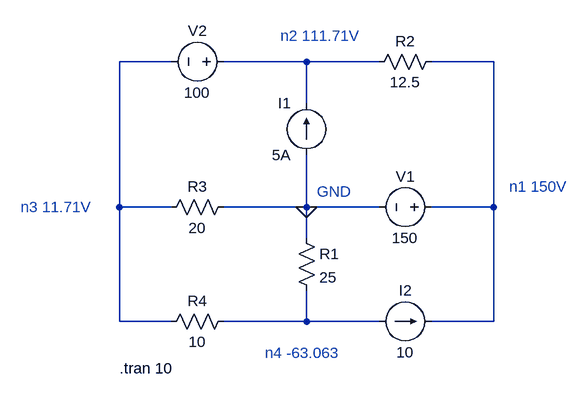
[diagram p0: schematic tc3_sim.asc]
tc3_sim.asc, the LTspice schematic file:
Version 4
SHEET 1 880 680
WIRE 32 -16 -48 -16
WIRE 240 -16 112 -16
WIRE 352 -16 240 -16
WIRE 528 -16 432 -16
WIRE 240 48 240 -16
WIRE -48 208 -48 -16
WIRE 32 208 -48 208
WIRE 240 208 240 128
WIRE 240 208 112 208
WIRE 352 208 240 208
WIRE 528 208 528 -16
WIRE 528 208 432 208
WIRE 240 256 240 208
WIRE -48 384 -48 208
WIRE 32 384 -48 384
WIRE 240 384 240 336
WIRE 240 384 112 384
WIRE 352 384 240 384
WIRE 528 384 528 208
WIRE 528 384 432 384
FLAG 240 208 0
SYMBOL voltage 448 208 R90
WINDOW 0 -32 56 VBottom 2
WINDOW 3 32 56 VTop 2
WINDOW 123 0 0 Left 0
WINDOW 39 0 0 Left 0
SYMATTR InstName V1
SYMATTR Value 150
SYMBOL current 240 128 R180
WINDOW 0 24 80 Left 2
WINDOW 3 24 0 Left 2
WINDOW 123 0 0 Left 0
WINDOW 39 0 0 Left 0
SYMATTR InstName I1
SYMATTR Value 5A
SYMBOL current 352 384 R270
WINDOW 0 32 40 VTop 2
WINDOW 3 -32 40 VBottom 2
WINDOW 123 0 0 Left 0
WINDOW 39 0 0 Left 0
SYMATTR InstName I2
SYMATTR Value 10
SYMBOL res 224 240 R0
SYMATTR InstName R1
SYMATTR Value 25
SYMBOL res 448 -32 R90
WINDOW 0 0 56 VBottom 2
WINDOW 3 32 56 VTop 2
SYMATTR InstName R2
SYMATTR Value 12.5
SYMBOL voltage 128 -16 R90
WINDOW 0 -32 56 VBottom 2
WINDOW 3 32 56 VTop 2
SYMATTR InstName V2
SYMATTR Value 100
SYMBOL res 128 192 R90
WINDOW 0 0 56 VBottom 2
WINDOW 3 32 56 VTop 2
SYMATTR InstName R3
SYMATTR Value 20
SYMBOL res 128 368 R90
WINDOW 0 0 56 VBottom 2
WINDOW 3 32 56 VTop 2
SYMATTR InstName R4
SYMATTR Value 10
TEXT 256 184 Left 2 ;GND
TEXT 552 176 Left 2 ;n1 150V
TEXT -48 456 Left 2 !.tran 10
TEXT 200 -56 Left 2 ;n2 111.71V
TEXT -200 208 Left 2 ;n3 11.71V
TEXT 176 432 Left 2 ;n4 -63.063

The netlist it stands for:
* tc3_sim.asc
V1 N003 0 150
I1 0 N002 5A
I2 N004 N003 10
R1 0 N004 25
R2 N003 N002 12.5
V2 N002 N001 100
R3 0 N001 20
R4 N004 N001 10
* GND
* n1 150V
.tran 10
* n2 111.71V
* n3 11.71V
* n4 -63.063
.backanno
.end